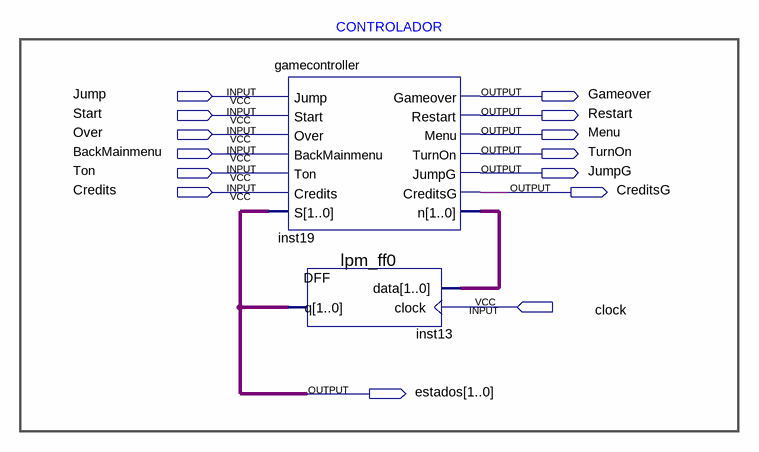
[diagram p0: schematic sheet]
// Quartus schematic controlador.bdf as structural Verilog: 2 symbols, 14 pins
module controlador (
  input  Jump,
  input  Start,
  input  Over,
  input  BackMainmenu,
  input  Ton,
  input  Credits,
  input  clock,
  output Gameover,
  output Restart,
  output Menu,
  output TurnOn,
  output JumpG,
  output CreditsG,
  output [1:0] estados
);

  wire [1:0] inst19_n;

  gamecontroller inst19 (
    .Jump(Jump), .Start(Start), .Over(Over), .BackMainmenu(BackMainmenu), .Ton(Ton), .Credits(Credits),
    .S(estados), .Gameover(Gameover), .Restart(Restart), .Menu(Menu), .TurnOn(TurnOn), .JumpG(JumpG),
    .CreditsG(CreditsG), .n(inst19_n));
  lpm_ff0 inst13 (.data(inst19_n), .clock(clock), .q(estados));

  // Notes on the sheet:
  //   CONTROLADOR
endmodule
